# EAGLE design sd2snes_revH (EAGLE 7.7.0)
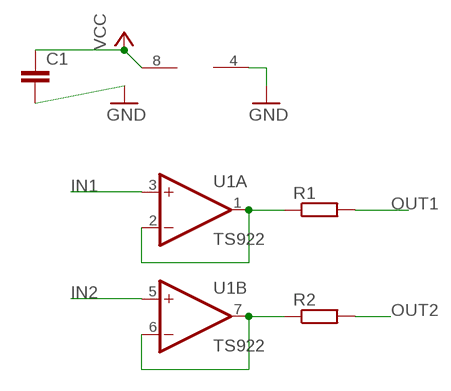
[diagram p0: schematic, sheet 1]

## Parts
C1  C-EUC0603  [C0603]
R1  R-EU_R0603  [R0603]
R2  R-EU_R0603  [R0603]
U1  TS922  TL072D  [SO08]

## Nets
GND: C1.2 U1.4(P:V-)
IN1: U1.3(A:+IN)
IN2: U1.5(B:+IN)
N$2: R1.1 U1.1(A:OUT) U1.2(A:-IN)
N$3: R2.1 U1.6(B:-IN) U1.7(B:OUT)
OUT1: R1.2
OUT2: R2.2
VCC: C1.1 U1.8(P:V+)

## Library data of the parts
C1 = rcl:C-EU: CAPACITOR, European symbol
R1 R2 = rcl:R-EU_: RESISTOR, European symbol
U1 = linear:TL072: OP AMP

## Board
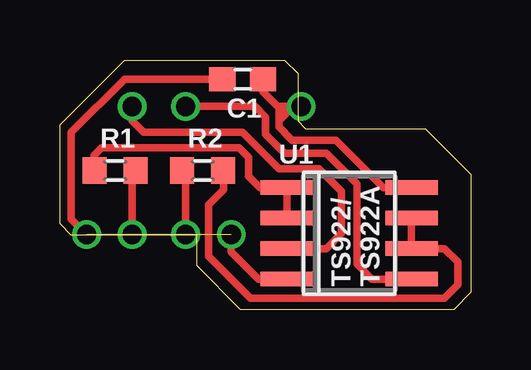
[diagram p1: board, top side]

Size 17.14 x 10.4 mm. Coordinates in mm from the lower left corner, seen from the top.
Outline: 0,7.7 2.7,10.4 9.37,10.4 9.92,9.84 9.92,7.86 10.24,7.54 15.24,7.54 17.14,5.64 17.14,0.71 16.43,0 7.54,0 5.71,1.83 5.71,3.1 0.48,3.1 0,3.57 0,7.7
Copper layers (1*16): Top 0.035mm / dielectric 1.5mm / Bottom 0.035mm
Design rules "ITEADstudio_DRC": minimum track width 6mil, minimum drill 12mil, track to track 6mil, track to pad 6mil, pad to pad 6mil, via to via 6mil, smd to smd 0mil, copper to edge 10mil, drill to drill 10mil, minimum pad ring 10mil, minimum via ring 6mil, stop-mask expansion 2mil, vias tented up to drill 30mil, thermal gap 10mil

### Footprints (pad centres in the part's own frame; a part is rotated, then mirrored left to right if it is on the bottom)
C0603 = smd 1.1 x 1: 1 -0.85,0; 2 0.85,0
R0603 = smd 1 x 1.1: 1 -0.85,0; 2 0.85,0
SO08 = smd 0.6 x 2.2: 1 -1.905,-2.6; 2 -0.635,-2.6; 3 0.635,-2.6; 4 1.905,-2.6; 5 1.905,2.6; 6 0.635,2.6; 7 -0.635,2.6; 8 -1.905,2.6

### Placement (x,y rotation side)
C1  7.62,9.6 180 top
R1  2.3,5.79 0 top
R2  5.95,5.79 180 top
U1  12.06,3.18 270 top

### Tracks (layer width: path | path; a pad name or v marks a point on that pad's centre or on a via)
GND  (via drill 0.8)  (1 unrouted)
  Top 0.305: U1.4 8.29,1.27 7.14,2.41 v7.14,3.13 | C1.2 2.7,9.6 0.48,7.38 0.48,3.76 v1.11,3.13
IN1  (via drill 0.8)
  Top 0.305: v3.02,8.46 3.02,7.86 3.49,7.38 7.62,7.38 9.13,5.87 10.79,5.87 11.75,4.92 11.75,3.18 11.11,2.54 U1.3
IN2  (via drill 0.8)
  Top 0.305: v5.24,8.46 8.13,8.46 8.57,8.02 8.57,7.3 9.37,6.51 11.11,6.51 12.38,5.24 12.38,1.91 13.02,1.27 U1.5
N$2
  Top 0.305: U1.2 U1.1 8.33,5.08 7.86,5.56 7.86,6.35 7.46,6.75 1.75,6.75 1.43,6.43 1.43,5.85 R1.1
N$3
  Top 0.305: U1.7 U1.6 16.03,2.54 16.59,1.98 16.59,1.03 16.03,0.48 7.94,0.48 6.19,2.22 6.19,4.37 6.83,5 6.83,5.74 R2.1
OUT1  (via drill 0.8)
  Top 0.305: v3.02,3.13 3.02,5.63 R1.2
OUT2  (via drill 0.8)
  Top 0.305: v5.24,3.13 5.24,5.64 R2.2
VCC  (via drill 0.8)
  Top 0.305: C1.1 8.47,9.07 9.08,8.46 v10.06,8.46 9.73,8.46 9.29,8.02 | 9.13,7.86 9.13,8.41 9.21,8.41 9.29,8.33 9.29,8.02 | 9.29,8.02 9.13,7.86 | 9.13,7.86 9.13,7.62 9.68,7.06 11.51,7.06 13.49,5.08 U1.8

### Text on the board
tNames: TS922/ / TS922A
bNames: sd2snes / Rev.H Ext. | Mod: Ikari_01 / PCB: borti4938